# Altium schematic sheet FIT_HDMI_X34-28.SchDoc: FIT_PM12 board
size 420 x 297 mm; CheckedBy: G.Kasprowicz; Author: INR Moscow; CompanyName: WUT ISE; DrawnBy: M.Podgórski; Organization: WUT ISE; Address1: PW ISE; Address2: Nowowiejska 15/19 00-665 Warsaw; Address3: gkasprow@gmail.com; Revision: 2; SheetNumber: -; SheetTotal: -; ModifiedBy: -; CheckedDate: -; Title2: Title 2; DivGrp: WUT ISE; Designer: INR RAS; ModifiedDate: -; ProjectName: Sensor Box
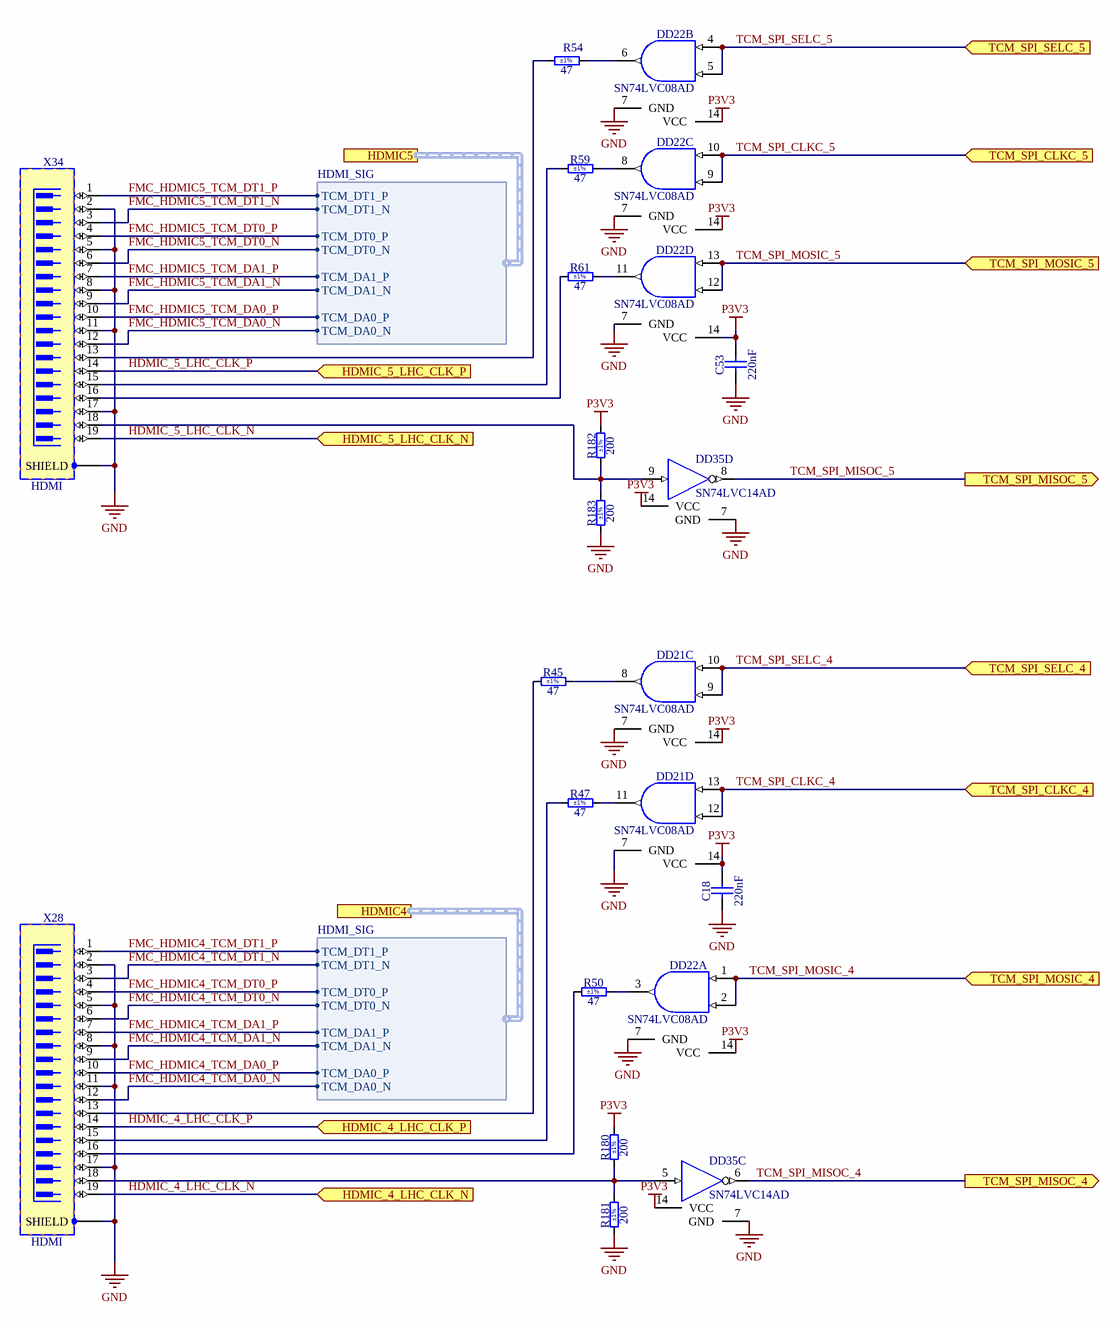
[diagram p0: FIT_HDMI_X34-28.SchDoc]

## Parts
C18  220nF  [CAPC2012X135N]
C53  220nF  [CAPC2012X135N]
DD21  SN74LVC08AD  [SOIC127P600X175-14N]  (parts C,D of 4)
DD22  SN74LVC08AD  [SOIC127P600X175-14N]  (parts A,B,C,D of 4)
DD35  SN74LVC14AD  [SOIC127P600X175-14N]  (parts C,D of 6)
R45  47  Tolerance: ±1%  [RESC2012X60N]
R47  47  Tolerance: ±1%  [RESC2012X60N]
R50  47  Tolerance: ±1%  [RESC2012X60N]
R54  47  Tolerance: ±1%  [RESC2012X60N]
R59  47  Tolerance: ±1%  [RESC2012X60N]
R61  47  Tolerance: ±1%  [RESC2012X60N]
R180  200  Tolerance: ±1%  [RESC2012X60N]
R181  200  Tolerance: ±1%  [RESC2012X60N]
R182  200  Tolerance: ±1%  [RESC2012X60N]
R183  200  Tolerance: ±1%  [RESC2012X60N]
X28  HDMI  [TYCO_2007435-1]
X34  HDMI  [TYCO_2007435-1]

## Ports
HDMIC4 (harness HDMI_SIG), HDMIC5 (harness HDMI_SIG), HDMIC_4_LHC_CLK_N (in), HDMIC_4_LHC_CLK_P (in), HDMIC_5_LHC_CLK_N (in), HDMIC_5_LHC_CLK_P (in), TCM_SPI_CLKC_4 (in), TCM_SPI_CLKC_5 (in), TCM_SPI_MISOC_4 (out), TCM_SPI_MISOC_5 (out), TCM_SPI_MOSIC_4 (in), TCM_SPI_MOSIC_5 (in), TCM_SPI_SELC_4 (in), TCM_SPI_SELC_5 (in)

## Harnesses
HDMI_SIG: TCM_DT1_P, TCM_DT1_N, TCM_DT0_P, TCM_DT0_N, TCM_DA1_P, TCM_DA1_N, TCM_DA0_P, TCM_DA0_N

## Nets
GND: C18.1 C53.1 DD21.7(GND) DD22.7(GND) DD35.7(GND) R181.1 R183.1 X28.2 X28.5 X28.8 X28.11 X28.17 X28.SHIELD X34.2 X34.5 X34.8 X34.11 X34.17 X34.SHIELD
P3V3: C18.2 C53.2 DD21.14(VCC) DD22.14(VCC) DD35.14(VCC) R180.2 R182.2  [also labelled VCC]
FMC_HDMIC4_TCM_DA0_N: X28.12 ; port HDMIC4.TCM_DA0_N
FMC_HDMIC4_TCM_DA0_P: X28.10 ; port HDMIC4.TCM_DA0_P
FMC_HDMIC4_TCM_DA1_N: X28.9 ; port HDMIC4.TCM_DA1_N
FMC_HDMIC4_TCM_DA1_P: X28.7 ; port HDMIC4.TCM_DA1_P
FMC_HDMIC4_TCM_DT0_N: X28.6 ; port HDMIC4.TCM_DT0_N
FMC_HDMIC4_TCM_DT0_P: X28.4 ; port HDMIC4.TCM_DT0_P
FMC_HDMIC4_TCM_DT1_N: X28.3 ; port HDMIC4.TCM_DT1_N
FMC_HDMIC4_TCM_DT1_P: X28.1 ; port HDMIC4.TCM_DT1_P
FMC_HDMIC5_TCM_DA0_N: X34.12 ; port HDMIC5.TCM_DA0_N
FMC_HDMIC5_TCM_DA0_P: X34.10 ; port HDMIC5.TCM_DA0_P
FMC_HDMIC5_TCM_DA1_N: X34.9 ; port HDMIC5.TCM_DA1_N
FMC_HDMIC5_TCM_DA1_P: X34.7 ; port HDMIC5.TCM_DA1_P
FMC_HDMIC5_TCM_DT0_N: X34.6 ; port HDMIC5.TCM_DT0_N
FMC_HDMIC5_TCM_DT0_P: X34.4 ; port HDMIC5.TCM_DT0_P
FMC_HDMIC5_TCM_DT1_N: X34.3 ; port HDMIC5.TCM_DT1_N
FMC_HDMIC5_TCM_DT1_P: X34.1 ; port HDMIC5.TCM_DT1_P
HDMIC_4_LHC_CLK_N: X28.19 ; port HDMIC_4_LHC_CLK_N
HDMIC_4_LHC_CLK_P: X28.14 ; port HDMIC_4_LHC_CLK_P
HDMIC_5_LHC_CLK_N: X34.19 ; port HDMIC_5_LHC_CLK_N
HDMIC_5_LHC_CLK_P: X34.14 ; port HDMIC_5_LHC_CLK_P
TCM_SPI_CLKC_4: DD21.12(B) DD21.13(A) ; port TCM_SPI_CLKC_4
TCM_SPI_CLKC_5: DD22.9(B) DD22.10(A) ; port TCM_SPI_CLKC_5
TCM_SPI_MISOC_4: DD35.6(OUT) ; port TCM_SPI_MISOC_4
TCM_SPI_MISOC_5: DD35.8(OUT) ; port TCM_SPI_MISOC_5
TCM_SPI_MOSIC_4: DD22.1(A) DD22.2(B) ; port TCM_SPI_MOSIC_4
TCM_SPI_MOSIC_5: DD22.12(B) DD22.13(A) ; port TCM_SPI_MOSIC_5
TCM_SPI_SELC_4: DD21.9(B) DD21.10(A) ; port TCM_SPI_SELC_4
TCM_SPI_SELC_5: DD22.4(A) DD22.5(B) ; port TCM_SPI_SELC_5
NetDD21_8: DD21.8(Y) R45.2
NetDD21_11: DD21.11(Y) R47.2
NetDD22_3: DD22.3(Y) R50.2
NetDD22_6: DD22.6(Y) R54.2
NetDD22_8: DD22.8(Y) R59.2
NetDD22_11: DD22.11(Y) R61.2
NetDD35_5: DD35.5(IN) R180.1 R181.2 X28.18
NetDD35_9: DD35.9(IN) R182.1 R183.2 X34.18
NetR45_1: R45.1 X28.13
NetR47_1: R47.1 X28.15
NetR50_1: R50.1 X28.16
NetR54_1: R54.1 X34.13
NetR59_1: R59.1 X34.15
NetR61_1: R61.1 X34.16

## Notes on the sheet
- Project/Equipment
- Document
- Designer
- Drawn by
- Check.by
- Copyright WUT ISE 2024.
  This documentation describes Open Hardware and is licensed under the CERN OHL v.2. You may redistribute and modify this documentation under the terms of the CERN OHL v.2. (http://ohwr.org/CERNOHL). This documentation is distributed WITHOUT ANY EXPRESS OR IMPLIED WARRANTY, INCLUDING OF MERCHANTABILITY, SATISFACTORY QUALITY AND FITNESS FOR A PARTICULAR PURPOSE. Please see the CERN OHL v.2 for applicable conditions.
- Contact
- File
- Last Mod.
- Print Date
- Sheet
- Size
- A3
- of
- Rev

## Library data of the parts
C18 C53 = CC0805_220NF_50V_10%_X7R: Non-polarised capacitor; Part Description: SMD Multilayer Chip Ceramic Capacitor; Manufacturer: GENERIC; Manufacturer1 Part Number: GRM21BR71H224KA01L; Voltage: 50V; TC: X7R; Tolerance: ±10%; Part Number: CC0805_220NF_50V_10%_X7R; Component Kind: Standard; Component Type: Standard; Pin Count: 2; Value: 220nF; Status: Preferred; Manufacturer Part Number: CC0805_220NF_50V_10%_X7R; Case: 0805; Mounted: Yes; Socket: No; SMD: Yes; Sense: No; Manufacturer1 Example: MURATA; Manufacturer1 ComponentHeight: 1.35mm; HelpURL: \\cern.ch\dfs\Applications\Altium\Datasheets\CC0805_X7R_MURATA.pdf; Author: CERN DEM JLC; CreateDate: 03.12.2007; LatestRevisionDate: 03.12.2007
DD21 DD22 = SN74LVC08AD: Quad 2-Input AND Gate; Part Description: Quadruple 2-Input Positive-AND Gate; Manufacturer: TEXAS INSTRUMENTS; PressFit: No; Bonding: No; Part Number: SN74LVC08AD; Component Kind: Standard; Component Type: Standard; Device: SN74LVC08AD; PackageDescription: SOIC 14, Pitch 1.27mm - Body 4x8.75mm, IPC Medium Density; Manufacturer Part Number: SN74LVC08AD; Pin Count: 14; Case: SOIC14; Mounted: Yes; Socket: No; SMD: Yes; Sense: No; ComponentHeight: 1.75mm; Author: CERN DEM JLC; HelpURL: \\cern.ch\dfs\Applications\Altium\Datasheets\SN74LVC08AD.pdf; CreateDate: 21.03.2012; LatestRevisionDate: 21.03.2012
DD35 = SN74LVC14AD: Hex Schmitt-Trigger Inverter; Manufacturer: TEXAS INSTRUMENTS; PressFit: No; Bonding: No; Part Number: SN74LVC14AD; Component Kind: Standard; Component Type: Standard; Device: SN74LVC14AD; PackageDescription: SOIC 14, Pitch 1.27mm - Body 4x8.75mm, IPC Medium Density; Part Description: Hex Schmitt-Trigger Inverter; Manufacturer Part Number: SN74LVC14AD; Pin Count: 14; Case: SOIC14; Mounted: Yes; Socket: No; SMD: Yes; Sense: No; ComponentHeight: 1.75mm; Author: CERN DEM JMW; HelpURL: \\cern.ch\dfs\Applications\Altium\Datasheets\SN74LVC14AD.pdf; CreateDate: 29.09.2008; LatestRevisionDate: 29.09.2008
R45 R47 R50 R54 R59 R61 = R0805_47R_1%_0.125W_100PPM: Resistor - 1%; Part Description: General Purpose Thick Film Chip Resistor; Manufacturer: GENERIC; Manufacturer1 Part Number: NRC10F47R0TRF; Power: 0.125W; TC: ±100ppm/°C; PressFit: No; Part Number: R0805_47R_1%_0.125W_100PPM; Component Kind: Standard; Component Type: Standard; Pin Count: 2; Value: 47; Status: Preferred; Manufacturer Part Number: R0805_47R_1%_0.125W_100PPM; Case: 0805; Mounted: Yes; Sense: No; Socket: No; SMD: Yes; Manufacturer1 Example: NIC COMPONENT; Manufacturer1 ComponentHeight: 0.6mm; HelpURL: \\cern.ch\dfs\Applications\Altium\Datasheets\R0805_NIC_NRC.pdf; Author: CERN DEM JLC; CreateDate: 03.12.2007; LatestRevisionDate: 13.03.2008
R180-R183 = R0805_200R_1%_0.125W_100PPM: Resistor - 1%; Part Description: General Purpose Thick Film Chip Resistor; Manufacturer: GENERIC; Manufacturer1 Part Number: NRC10F2000TRF; Power: 0.125W; TC: ±100ppm/°C; PressFit: No; Part Number: R0805_200R_1%_0.125W_100PPM; Component Kind: Standard; Component Type: Standard; Pin Count: 2; Value: 200; Status: Preferred; Manufacturer Part Number: R0805_200R_1%_0.125W_100PPM; Case: 0805; Mounted: Yes; Sense: No; Socket: No; SMD: Yes; Manufacturer1 Example: NIC COMPONENT; Manufacturer1 ComponentHeight: 0.6mm; HelpURL: \\cern.ch\dfs\Applications\Altium\Datasheets\R0805_NIC_NRC.pdf; Author: CERN DEM JLC; CreateDate: 03.12.2007; LatestRevisionDate: 13.03.2008
X28 X34 = TYCO_2007435-1: Connector HDMI 19 Male + 1 Shield; Part Description: 0.578mm Pitch, Through-Hole Right Angle 19 Contacts Flag-HDMI Type-A Receptacle Thru Hole Mounting Pads; Manufacturer: TYCO ELECTRONICS; PressFit: No; Part Number: TYCO_2007435-1; Component Kind: Standard; Component Type: Standard; Pin Count: 23; Family: HDMI; Mounted: Yes; Socket: No; SMD: No; Sense: No; Status: None; Manufacturer Part Number: 2007435-1; ComponentHeight: 16.4mm; HelpURL: \\cern.ch\dfs\Applications\Altium\Datasheets\TYCO_2007435-1.pdf; Author: CERN DEM MR; CreateDate: 05.07.2016; LatestRevisionDate: 05.07.2016